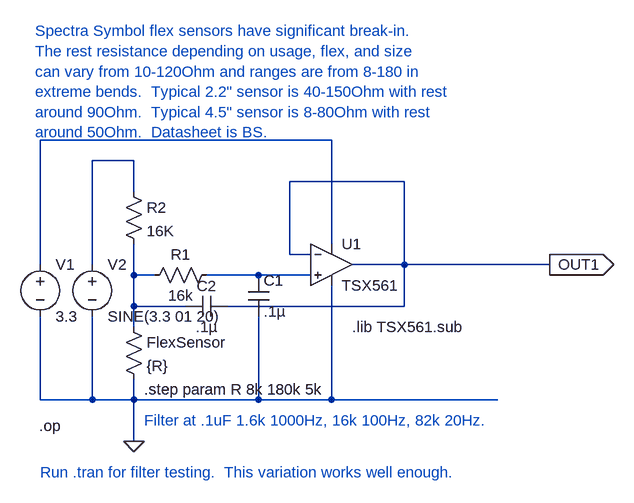
[diagram p0: schematic FlexADCBuffer.asc]
FlexADCBuffer.asc, the LTspice schematic file:
Version 4
SHEET 1 2280 680
WIRE 448 -96 0 -96
WIRE 144 -64 80 -64
WIRE 560 -32 384 -32
WIRE 144 -16 144 -64
WIRE 448 64 448 -96
WIRE 384 80 384 -32
WIRE 416 80 384 80
WIRE 0 96 0 -96
WIRE 80 96 80 -64
WIRE 560 96 560 -32
WIRE 560 96 480 96
WIRE 784 96 560 96
WIRE 144 112 144 64
WIRE 176 112 144 112
WIRE 336 112 256 112
WIRE 416 112 336 112
WIRE 144 160 144 112
WIRE 224 160 144 160
WIRE 560 160 560 96
WIRE 560 160 288 160
WIRE 144 192 144 160
WIRE 0 304 0 176
WIRE 80 304 80 176
WIRE 80 304 0 304
WIRE 144 304 144 272
WIRE 144 304 80 304
WIRE 336 304 336 176
WIRE 336 304 144 304
WIRE 448 304 448 128
WIRE 448 304 336 304
WIRE 704 304 448 304
WIRE 144 368 144 304
FLAG 144 368 0
FLAG 784 96 OUT1
IOPIN 784 96 Out
SYMBOL voltage 0 80 R0
WINDOW 123 0 0 Left 2
WINDOW 39 0 0 Left 2
SYMATTR InstName V1
SYMATTR Value 3.3
SYMBOL res 128 -32 R0
SYMATTR InstName R2
SYMATTR Value 16K
SYMBOL Opamps\\opamp2 448 32 R0
SYMATTR InstName U1
SYMATTR Value TSX561
SYMBOL res 272 96 R90
WINDOW 0 0 56 VBottom 2
WINDOW 3 32 56 VTop 2
SYMATTR InstName R1
SYMATTR Value 16k
SYMBOL cap 320 112 R0
SYMATTR InstName C1
SYMATTR Value .1µ
SYMBOL cap 288 144 R90
WINDOW 0 0 32 VBottom 2
WINDOW 3 32 32 VTop 2
SYMATTR InstName C2
SYMATTR Value .1µ
SYMBOL voltage 80 80 R0
WINDOW 123 0 0 Left 2
WINDOW 39 0 0 Left 2
SYMATTR InstName V2
SYMATTR Value SINE(3.3 01 20)
SYMBOL res 128 176 R0
SYMATTR InstName FlexSensor
SYMATTR Value {R}
TEXT 160 288 Left 2 !.step param R 8k 180k 5k
TEXT -2 344 Left 2 !.op
TEXT 480 192 Left 2 !.lib TSX561.sub
TEXT 160 336 Left 2 ;Filter at .1uF 1.6k 1000Hz, 16k 100Hz, 82k 20Hz.
TEXT -8 -264 Left 2 ;Spectra Symbol flex sensors have significant break-in.  \nThe rest resistance depending on usage, flex, and size\ncan vary from 10-120Ohm and ranges are from 8-180 in\nextreme bends.  Typical 2.2" sensor is 40-150Ohm with rest\naround 90Ohm.  Typical 4.5" sensor is 8-80Ohm with rest\naround 50Ohm.  Datasheet is BS.
TEXT 0 416 Left 2 ;Run .tran for filter testing.  This variation works well enough.

The netlist it stands for:
* FlexADCBuffer.asc
V1 N001 0 3.3
R2 N002 N003 16K
XU1 N004 OUT1 N001 0 OUT1 TSX561  ; pins In+ In- V+ V- OUT
R1 N004 N003 16k
C1 N004 0 .1µ
C2 OUT1 N003 .1µ
V2 N002 0 SINE(3.3 01 20)
R§FlexSensor N003 0 {R}
.step param R 8k 180k 5k
.op
.lib TSX561.sub
* Filter at .1uF 1.6k 1000Hz, 16k 100Hz, 82k 20Hz.
* Spectra Symbol flex sensors have significant break-in.
* The rest resistance depending on usage, flex, and size
* can vary from 10-120Ohm and ranges are from 8-180 in
* extreme bends.  Typical 2.2" sensor is 40-150Ohm with rest
* around 90Ohm.  Typical 4.5" sensor is 8-80Ohm with rest
* around 50Ohm.  Datasheet is BS.
* Run .tran for filter testing.  This variation works well enough.
.backanno
.end